# EAGLE design Battery Board V5 2 layer (EAGLE 8.4.3)
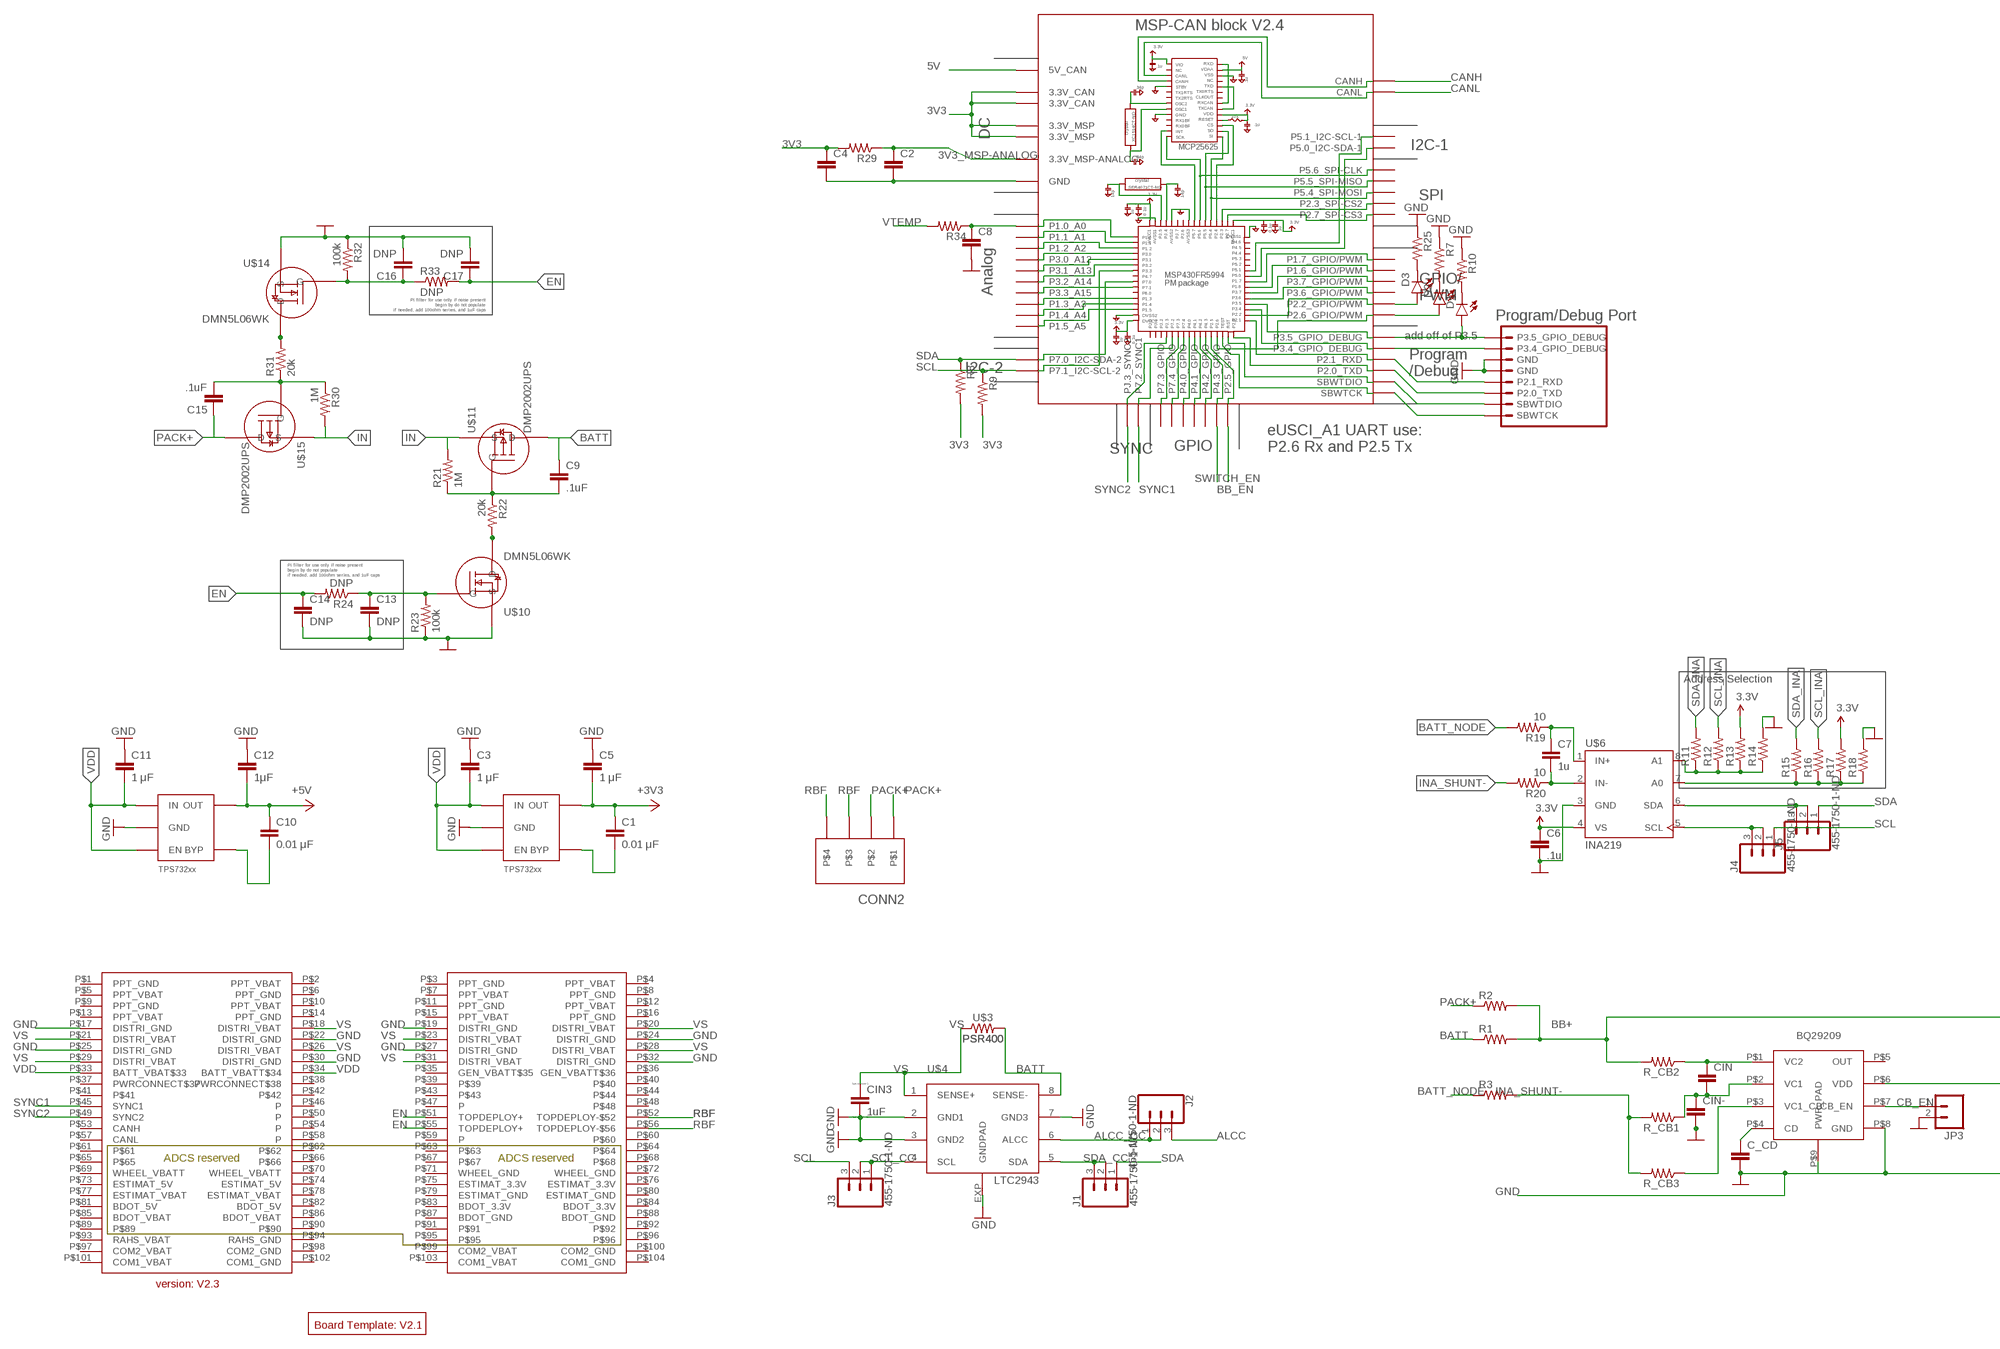
[diagram p0: schematic, sheet 1, part 1 of 2]
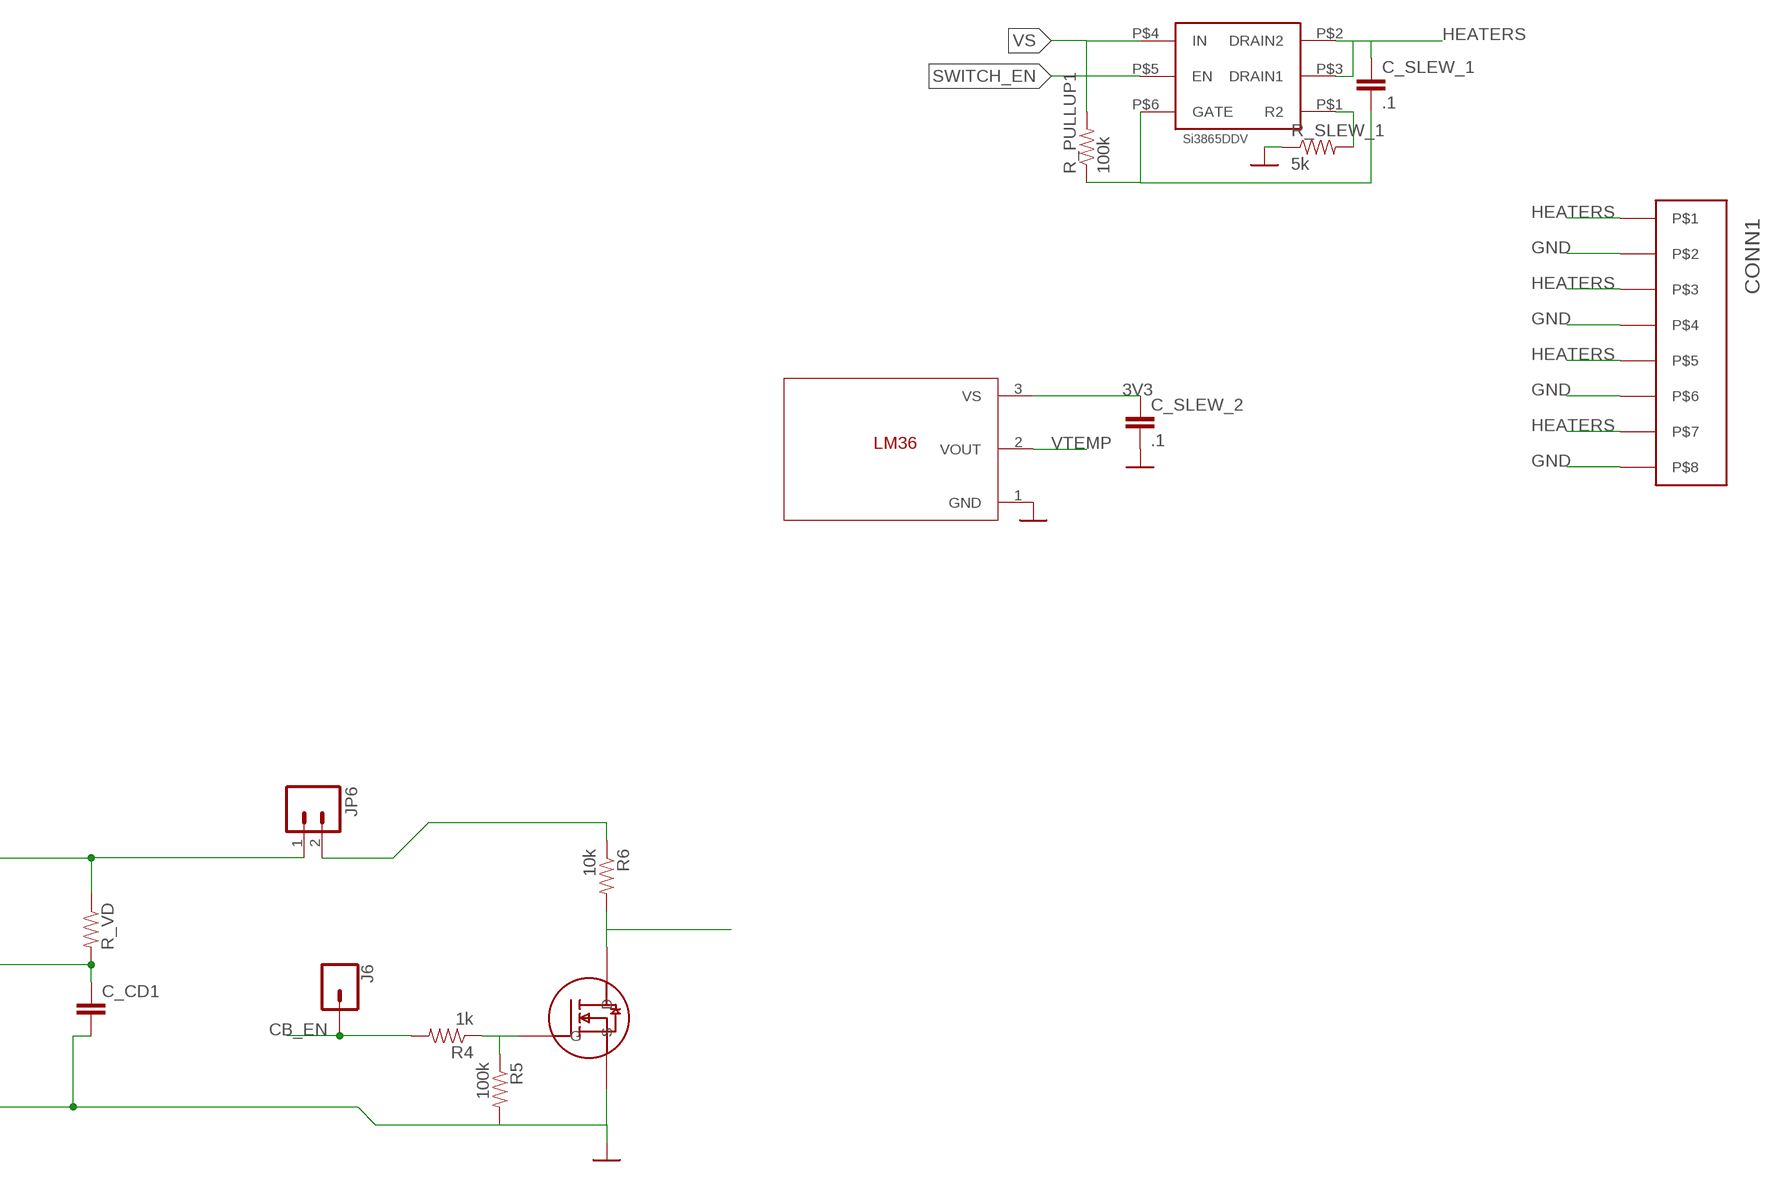
[diagram p1: schematic, sheet 1, part 2 of 2]

## Parts
BLK1  MSP-CAN_BLOCK  [MSP-CAN_BLOCK]
C1  0.01 μF  CAPACITOR0805  [0805]
C2  CAPACITOR0805  [0805]
C3  1 μF  CAPACITOR0805  [0805]
C4  CAPACITOR0805  [0805]
C5  1 μF  CAPACITOR0805  [0805]
C6  .1u  CAPACITOR0805  [0805]
C7  1u  CAPACITOR0805  [0805]
C8  CAPACITOR0805  [0805]
C9  .1uF  CAPACITOR0805  [0805]
C10  0.01 μF  CAPACITOR0805  [0805]
C11  1 μF  CAPACITOR0805  [0805]
C12  1μF  CAPACITOR0805  [0805]
C13  DNP  CAPACITOR0805  [0805]
C14  DNP  CAPACITOR0805  [0805]
C15  .1uF  CAPACITOR0805  [0805]
C16  DNP  CAPACITOR0805  [0805]
C17  DNP  CAPACITOR0805  [0805]
C_CD  CAPACITOR0805  [0805]
C_CD1  CAPACITOR0805  [0805]
C_SLEW_1  .1  CAPACITOR0805  [0805]
C_SLEW_2  .1  CAPACITOR0805  [0805]
CIN  CAPACITOR0805  [0805]
CIN3  1uF  C  [C0805]
CIN-  CAPACITOR0805  [0805]
CONN1  PICOLOCK_8  [PICOLOCK_8]
CONN2  PICOLOCK_4  [PICOLOCK_4]
D1  LED  [LED-1206]
D2  LED  [LED-1206]
D3  LED  [LED-1206]
J1  455-1750-1-ND  CONN_03  [1X03]
J2  455-1750-1-ND  CONN_03  [1X03]
J3  455-1750-1-ND  CONN_03  [1X03]
J4  455-1750-1-ND  CONN_03  [1X03]
J5  455-1750-1-ND  CONN_03  [1X03]
J6  CONN_01  [1X01]
JP3  M02LOCK  [1X02_LOCK]
JP6  M02LOCK  [1X02_LOCK]
R1  RESISTOR0805  [0805]
R2  RESISTOR0805  [0805]
R3  RESISTOR2010  [R2010]
R4  1k  RESISTOR0805  [0805]
R5  100k  RESISTOR0805  [0805]
R6  10k  RESISTOR0805  [0805]
R7  RESISTOR0805  [0805]
R8  RESISTOR0805  [0805]
R9  RESISTOR0805  [0805]
R10  RESISTOR0805  [0805]
R11  RESISTOR0805  [0805]
R12  RESISTOR0805  [0805]
R13  RESISTOR0805  [0805]
R14  RESISTOR0805  [0805]
R15  RESISTOR0805  [0805]
R16  RESISTOR0805  [0805]
R17  RESISTOR0805  [0805]
R18  RESISTOR0805  [0805]
R19  10  RESISTOR0805  [0805]
R20  10  RESISTOR0805  [0805]
R21  1M  RESISTOR0805  [0805]
R22  20k  RESISTOR0805  [0805]
R23  100k  RESISTOR0805  [0805]
R24  DNP  RESISTOR0805  [0805]
R25  RESISTOR0805  [0805]
R29  RESISTOR0805  [0805]
R30  1M  RESISTOR0805  [0805]
R31  20k  RESISTOR0805  [0805]
R32  100k  RESISTOR0805  [0805]
R33  DNP  RESISTOR0805  [0805]
R34  RESISTOR0805  [0805]
R_CB1  RESISTOR0805  [0805]
R_CB2  RESISTOR0805  [0805]
R_CB3  RESISTOR0805  [0805]
R_PULLUP1  100k  RESISTOR0805  [0805]
R_SLEW_1  5k  RESISTOR0805  [0805]
R_VD  RESISTOR0805  [0805]
U1  TPS732XX  [SOT-23-5]
U4  TPS732XX  [SOT-23-5]
U$1  BOARD_TEMPLATE1  [BOARD_TEMPLATE]
U$2  PC104_CONNECTOR  [PC104_CONNECTOR]
U$3  PSR400  [PSR400]
U$4  LTC2943  [DFN8(3X3)LT]
U$5  BQ29209  [VSON8]
U$6  INA219  [SOT-23-8]
U$7  DMN62D0U  [SOT-23-3]
U$8  LM36  [TO-92-3]
U$10  DMN5L06WK  [SOT-323]
U$11  DMP2002UPS  [POWERDI5060-8]
U$12  PROGRAM/DEBUG_PORT  [1X08_CONNECTOR]
U$14  DMN5L06WK  [SOT-323]
U$15  DMP2002UPS  [POWERDI5060-8]
U$16  SI3865DDV  [TSOP-6]

## Nets
3V3: BLK1.3.3V@CAN1(3.3V_CAN) BLK1.3.3V@CAN2(3.3V_CAN) BLK1.3.3V@MSP1(3.3V_MSP) BLK1.3.3V@MSP2(3.3V_MSP) C1.1 C4.1 C5.2 C6.1 C_SLEW_2.1 R8.2 R9.2 R13.2 R17.2 R29.2 U1.P$5(OUT) U$6.4(VS) U$8.3(VS) ; supply symbol labelled +3V3, 3.3V
3V3_MSP-ANALOG: BLK1.3.3V_ANALOG@MSP2(3.3V_MSP-ANALOG) C2.1 R29.1
5V: BLK1.5V(5V_CAN) C10.1 C12.2 U4.P$5(OUT) ; supply symbol labelled +5V
ALCC: J2.3
ALCC_CC: J2.1 J2.2 U$4.6(ALCC)
BATT: C9.1 R1.1 U$3.P$2 U$4.8(SENSE-) U$11.D1(D) U$11.D2(D) U$11.D3(D) U$11.D4(D) U$11.D5(D)
BATT_NODE: R3.1 R19.2
BB+: JP6.1 R1.2 R2.2 R_CB2.2 R_VD.1
BB_EN: BLK1.P2.5_GPIO R6.2 U$7.3(D)
CANH: BLK1.CANH
CANL: BLK1.CANL
CB_EN: J6.1 JP3.1 R4.2 U$5.P$7(CB_EN)
EN: C14.1 C17.1 R24.2 R33.2 U$2.P$51(TOPDEPLOY+) U$2.P$55(TOPDEPLOY+)
GND: BLK1.GND@1(GND) BLK1.GND@2(GND) BLK1.GND@3(GND) BLK1.GND@4(GND) BLK1.GND@5(GND) BLK1.GND@7(GND) BLK1.GND@8(GND) BLK1.GND@9(GND) BLK1.GND@10(GND) BLK1.GND@11(GND) BLK1.GND@12(GND) BLK1.GND@13(GND) BLK1.GND@14(GND) BLK1.GND@15(GND) BLK1.GND@16(GND) BLK1.GND@17(GND) BLK1.GND@26(GND) C2.2 C3.1 C4.2 C5.1 C6.2 C8.2 C11.1 C12.1 C13.2 C14.2 C16.2 C17.2 C_CD1.2 C_CD.2 C_SLEW_2.2 CIN3.2 CIN-.2 CONN1.P$2 CONN1.P$4 CONN1.P$6 CONN1.P$8 JP3.2 R5.2 R7.1 R10.1 R14.2 R18.2 R23.1 R25.1 R32.1 R_SLEW_1.1 U1.P$2(GND) U4.P$2(GND) U$2.P$17(DISTRI_GND) U$2.P$19(DISTRI_GND) U$2.P$22(DISTRI_GND) U$2.P$24(DISTRI_GND) U$2.P$25(DISTRI_GND) U$2.P$27(DISTRI_GND) U$2.P$30(DISTRI_GND) U$2.P$32(DISTRI_GND) U$4.2(GND1) U$4.3(GND2) U$4.7(GND3) U$4.EXP(GNDPAD) U$5.P$8(GND) U$5.P$9(PWR_PAD) U$6.3(GND) U$7.2(S) U$8.1(GND) U$10.2(S) U$12.5(GND) U$12.6(GND) U$14.2(S) ; supply symbol labelled DGND
HEATERS: C_SLEW_1.1 CONN1.P$1 CONN1.P$3 CONN1.P$5 CONN1.P$7 U$16.P$2(DRAIN2) U$16.P$3(DRAIN1)
IN: R21.2 R30.2 U$11.S1(S) U$11.S2(S) U$11.S3(S) U$15.S1(S) U$15.S2(S) U$15.S3(S)
INA219_A0_1: R15.1 R16.1 R17.1 R18.1 U$6.7(A0)
INA219_A1_1: R11.1 R12.1 R13.1 R14.1 U$6.8(A1)
INA219_IN+_1: C7.1 R19.1 U$6.1(IN+)
INA219_IN-_1: C7.2 R20.1 U$6.2(IN-)
INA_SHUNT-: R3.2 R20.2 R_CB1.2 R_CB3.2
LDO_3V3_BYP1: C1.2 U1.P$4(BYP)
LDO_5V_BYP1: C10.2 U4.P$4(BYP)
N$1: BLK1.P3.5_GPIO_DEBUG D1.A U$12.8(P3.5_GPIO_DEBUG)
N$2: JP6.2 R6.1
N$3: BLK1.P3.4_GPIO_DEBUG U$12.7(P3.4_GPIO_DEBUG)
N$4: BLK1.P2.1_RXD U$12.4(P2.1_RXD)
N$5: CIN.1 R_CB2.1 U$5.P$1(VC2)
N$6: CIN-.1 CIN.2 R_CB1.1 U$5.P$2(VC1)
N$7: C9.2 R21.1 R22.1 U$11.G
N$8: C13.1 R23.2 R24.1 U$10.1(G)
N$9: R_CB3.1 U$5.P$3(VC1_CB)
N$10: C_CD.1 U$5.P$4(CD)
N$11: R22.2 U$10.3(D)
N$12: R4.1 R5.1 U$7.1(G)
N$13: C_CD1.1 R_VD.2 U$5.P$6(VDD)
N$14: C15.2 R30.1 R31.1 U$15.G
N$16: C16.1 R32.2 R33.1 U$14.1(G)
N$17: R31.2 U$14.3(D)
N$18: BLK1.P2.0_TXD U$12.3(P2.0_TXD)
N$19: BLK1.SBWTDIO U$12.2(SBWTDIO)
N$20: BLK1.SBWTCK U$12.SBWTCK
N$21: D1.C R10.2
N$22: BLK1.P1.0_A0 C8.1 R34.1
N$23: D2.C R7.2
N$24: D3.C R25.2
N$25: R_SLEW_1.2 U$16.P$1(R2)
N$26: C_SLEW_1.2 R_PULLUP1.1 U$16.P$6(GATE)
N$27: BLK1.P2.2_GPIO/PWM D3.A
N$28: BLK1.P2.6_GPIO/PWM D2.A
PACK+: C15.1 CONN2.P$1 CONN2.P$2 R2.1 U$15.D1(D) U$15.D2(D) U$15.D3(D) U$15.D4(D) U$15.D5(D)
RBF: CONN2.P$3 CONN2.P$4 U$2.P$52(TOPDEPLOY-$52) U$2.P$56(TOPDEPLOY-$56)
SCL: BLK1.P7.1_I2C-SCL-2 J3.3 J4.1 R9.1
SCL_CC: J3.1 J3.2 U$4.4(SCL)
SCL_INA: J4.2 J4.3 R12.2 R16.2 U$6.5(SCL)
SDA: BLK1.P7.0_I2C-SDA-2 J1.1 J5.1 R8.1
SDA_CC: J1.2 J1.3 U$4.5(SDA)
SDA_INA: J5.2 J5.3 R11.2 R15.2 U$6.6(SDA)
SWITCH_EN: BLK1.P4.3_GPIO U$16.P$5(EN)
SYNC1: BLK1.P7.2_SYNC1 U$2.P$45(SYNC1)
SYNC2: BLK1.PJ.3_SYNC2 U$2.P$49(SYNC2)
VDD: C3.2 C11.2 U1.P$1(IN) U1.P$3(EN) U4.P$1(IN) U4.P$3(EN) U$2.P$33(BATT_VBAT$33) U$2.P$34(BATT_VBATT$34)
VS: CIN3.1 R_PULLUP1.2 U$2.P$18(DISTRI_VBAT) U$2.P$20(DISTRI_VBAT) U$2.P$21(DISTRI_VBAT) U$2.P$23(DISTRI_VBAT) U$2.P$26(DISTRI_VBAT) U$2.P$28(DISTRI_VBAT) U$2.P$29(DISTRI_VBAT) U$2.P$31(DISTRI_VBAT) U$3.P$1 U$4.1(SENSE+) U$16.P$4(IN)
VTEMP: R34.2 U$8.2(VOUT)
Unconnected: BLK1.P1.1_A1 BLK1.P1.2_A2 BLK1.P1.3_A3 BLK1.P1.4_A4 BLK1.P1.5_A5 BLK1.P1.6_GPIO/PWM BLK1.P1.7_GPIO/PWM BLK1.P2.4_SPI-CS2(P2.3_SPI-CS2) BLK1.P2.7_SPI-CS3 BLK1.P3.0_A12 BLK1.P3.1_A13 BLK1.P3.2_A14 BLK1.P3.3_A15 BLK1.P3.6_GPIO/PWM BLK1.P3.7_GPIO/PWM BLK1.P4.0_GPIO BLK1.P4.1_GPIO BLK1.P4.2_GPIO BLK1.P5.0_I2C-SDA-1 BLK1.P5.1_I2C-SCL-1 BLK1.P5.4_SPI-MOSI BLK1.P5.5_SPI-MISO BLK1.P5.6_SPI-CLK BLK1.P7.3_GPIO BLK1.P7.4_GPIO U$2.P$1(PPT_GND) U$2.P$2(PPT_VBAT) U$2.P$3(PPT_GND) U$2.P$4(PPT_VBAT) U$2.P$5(PPT_VBAT) U$2.P$6(PPT_GND) U$2.P$7(PPT_VBAT) U$2.P$8(PPT_GND) U$2.P$9(PPT_GND) U$2.P$10(PPT_VBAT) U$2.P$11(PPT_GND) U$2.P$12(PPT_VBAT) U$2.P$13(PPT_VBAT) U$2.P$14(PPT_GND) U$2.P$15(PPT_VBAT) U$2.P$16(PPT_GND) U$2.P$35(GEN_VBATT$35) U$2.P$36(GEN_VBATT$36) U$2.P$37(PWRCONNECT$37) U$2.P$38(PWRCONNECT$38) U$2.P$39 U$2.P$40 U$2.P$41 U$2.P$42 U$2.P$43 U$2.P$44 U$2.P$46(P) U$2.P$47(P) U$2.P$48 U$2.P$50(P) U$2.P$53(CANH) U$2.P$54(P) U$2.P$57(CANL) U$2.P$58(P) U$2.P$59(P) U$2.P$60 U$2.P$61 U$2.P$62 U$2.P$63 U$2.P$64 U$2.P$65 U$2.P$66 U$2.P$67 U$2.P$68 U$2.P$69(WHEEL_VBATT) U$2.P$70(WHEEL_VBATT) U$2.P$71(WHEEL_GND) U$2.P$72(WHEEL_GND) U$2.P$73(ESTIMAT_5V) U$2.P$74(ESTIMAT_5V) U$2.P$75(ESTIMAT_3.3V) U$2.P$76(ESTIMAT_3.3V) U$2.P$77(ESTIMAT_VBAT) U$2.P$78(ESTIMAT_VBAT) U$2.P$79(ESTIMAT_GND) U$2.P$80(ESTIMAT_GND) U$2.P$81(BDOT_5V) U$2.P$82(BDOT_5V) U$2.P$83(BDOT_3.3V) U$2.P$84(BDOT_3.3V) U$2.P$85(BDOT_VBAT) U$2.P$86(BDOT_VBAT) U$2.P$87(BDOT_GND) U$2.P$88(BDOT_GND) U$2.P$89 U$2.P$90 U$2.P$91 U$2.P$92 U$2.P$93(RAHS_VBAT) U$2.P$94(RAHS_GND) U$2.P$95 U$2.P$96 U$2.P$97(COM2_VBAT) U$2.P$98(COM2_GND) U$2.P$99(COM2_VBAT) U$2.P$100(COM2_GND) U$2.P$101(COM1_VBAT) U$2.P$102(COM1_GND) U$2.P$103(COM1_VBAT) U$2.P$104(COM1_GND) U$5.P$5(OUT)

## Notes on the sheet
- Pi filter for use only if noise present
  begin by do not populate
  if needed, add 100ohm series, and 1uF caps
- Pi filter for use only if noise present
  begin by do not populate
  if needed, add 100ohm series, and 1uF caps
- Address Selection

## Library data of the parts
BLK1 = DubSat1 Components:MSP-CAN_BLOCK
C1-C17 C_CD C_CD1 C_SLEW_1 C_SLEW_2 CIN CIN- = DubSat1 Components:CAPACITOR: Capacitor Standard 0603 ceramic capacitor, and 0.1" leaded capacitor.
CIN3 = eagle-ltspice:C: CAPACITOR, European symbol; SPICEMODEL: NONE; SPICEPREFIX: C
CONN1 = DubSat1 Components:PICOLOCK_8
CONN2 = DubSat1 Components:PICOLOCK_4
D1-D3 = DubSat1 Components:LED
J1-J5 = SparkFun-Connectors:CONN_03: Multi connection point. Often used as Generic Header-pin footprint for 0.1 inch spaced/style header connections On any of the 0.1 inch spaced packages, you can populate with these: Break Away Headers - Straight <https://www.sparkfun.com/products/116> (PRT-00116) Break Away Male Headers - Right Angle <https://www.sparkfun.com/products/553> (PRT-00553) Female Headers <https://www.sparkfun.com/products/115> (PRT-00115) Break Away Headers - Machine Pin <https://www.sparkfun.com/products/117> (PRT-00117) Break Away Female Headers - Swiss Machine Pin <https://www.sparkfun.com/products/743> (PRT-00743) Stackable Header - 3 Pin (Female, 0.1") <https://www.sparkfun.com/products/13875> (PRT-13875) For SCREWTERMINALS and SPRING TERMINALS visit here: Screw Terimnals on SparkFun.com <https://www.sparkfun.com/search/results?term=Screw+Terminals> (5mm/3.5mm/2.54mm spacing) This device is also useful as a general connection point to wire up your design to another part of your project. Our various solder wires solder well into these plated through hole pads. Hook-Up Wire - Assortment (Stranded, 22 AWG) <https://www.sparkfun.com/products/11375> (PRT-11375) Hook-Up Wire - Assortment (Solid Core, 22 AWG) <https://www.sparkfun.com/products/11367> (PRT-11367) View the entire wire category on our website here <https://www.sparkfun.com/categories/141> Special notes: Molex polarized connector foot print use with SKU : PRT-08232 with associated crimp pins and housings.; PROD_ID: XXX-00000
J6 = SparkFun-Connectors:CONN_01: Single connection point. Often used as Generic Header-pin footprint for 0.1 inch spaced/style header connections On any of the 0.1 inch spaced packages, you can populate with these: Break Away Headers - Straight <https://www.sparkfun.com/products/116> (PRT-00116) Break Away Male Headers - Right Angle <https://www.sparkfun.com/products/553> (PRT-00553) Female Headers <https://www.sparkfun.com/products/115> (PRT-00115) Break Away Headers - Machine Pin <https://www.sparkfun.com/products/117> (PRT-00117) Break Away Female Headers - Swiss Machine Pin <https://www.sparkfun.com/products/743> (PRT-00743) This device is also useful as a general connection point to wire up your design to another part of your project. Our various solder wires solder well into these plated through hole pads. Hook-Up Wire - Assortment (Stranded, 22 AWG) <https://www.sparkfun.com/products/11375> (PRT-11375) Hook-Up Wire - Assortment (Solid Core, 22 AWG) <https://www.sparkfun.com/products/11367> (PRT-11367) View the entire wire category on our website here <https://www.sparkfun.com/categories/141> Special notes: SMTSO-256-ET is a "flush mount" nut for a 4-40 screw. We mostly use this on specialty testbeds; it is a nice way to connect hardware to your PCB at an adjustable hieght. Also note, the SNAP packages are for using a snappable style connector. We sell a baggie of snaps and they are also used on two LilyPad designs: Snap Assortment - 30 pack (male and female) <https://www.sparkfun.com/products/11347> (DEV-11347) LilyPad Arduino SimpleSnap <https://www.sparkfun.com/products/10941> (DEV-10941) LilyPad SimpleSnap Protoboard <https://www.sparkfun.com/products/10940> (DEV-10940)
JP3 JP6 = SparkFun-Connectors:M02: Standard 2-pin 0.1" header. Use with - straight break away headers ( PRT-00116) - right angle break away headers (PRT-00553) - swiss pins (PRT-00743) - machine pins (PRT-00117) - female headers (PRT-00115) Molex polarized connector foot print use with: PRT-08233 with associated crimp pins and housings. 2.54_SCREWTERM for use with PRT-10571. 3.5mm Screw Terminal footprints for PRT-08084 5mm Screw Terminal footprints for use with PRT-08432
R1-R25 R29-R34 R_CB1-R_CB3 R_PULLUP1 R_SLEW_1 R_VD = DubSat1 Components:RESISTOR: Resistor Basic schematic elements and footprints for 0603, 1206, and PTH resistors.
U1 U4 = DubSat1 Components:TPS732XX
U$1 = DubSat1 Components:BOARD_TEMPLATE
U$2 = DubSat1 Components:PC104_CONNECTOR
U$3 = Parts for Power Team1:PSR400
U$4 = Parts for Power Team1:LTC2943
U$5 = DubSat1 Components:BQ29209
U$6 = DubSat1 Components:INA219
U$7 = DubSat1 Components:DMN62D0U
U$8 = DubSat1 Components:LM36
U$10 U$14 = DubSat1 Components:DMN5L06WK
U$11 U$15 = DubSat1 Components:DMP2002UPS
U$12 = DubSat1 Components:PROGRAM/DEBUG_PORT
U$16 = DubSat1 Components:SI3865DDV

## Board
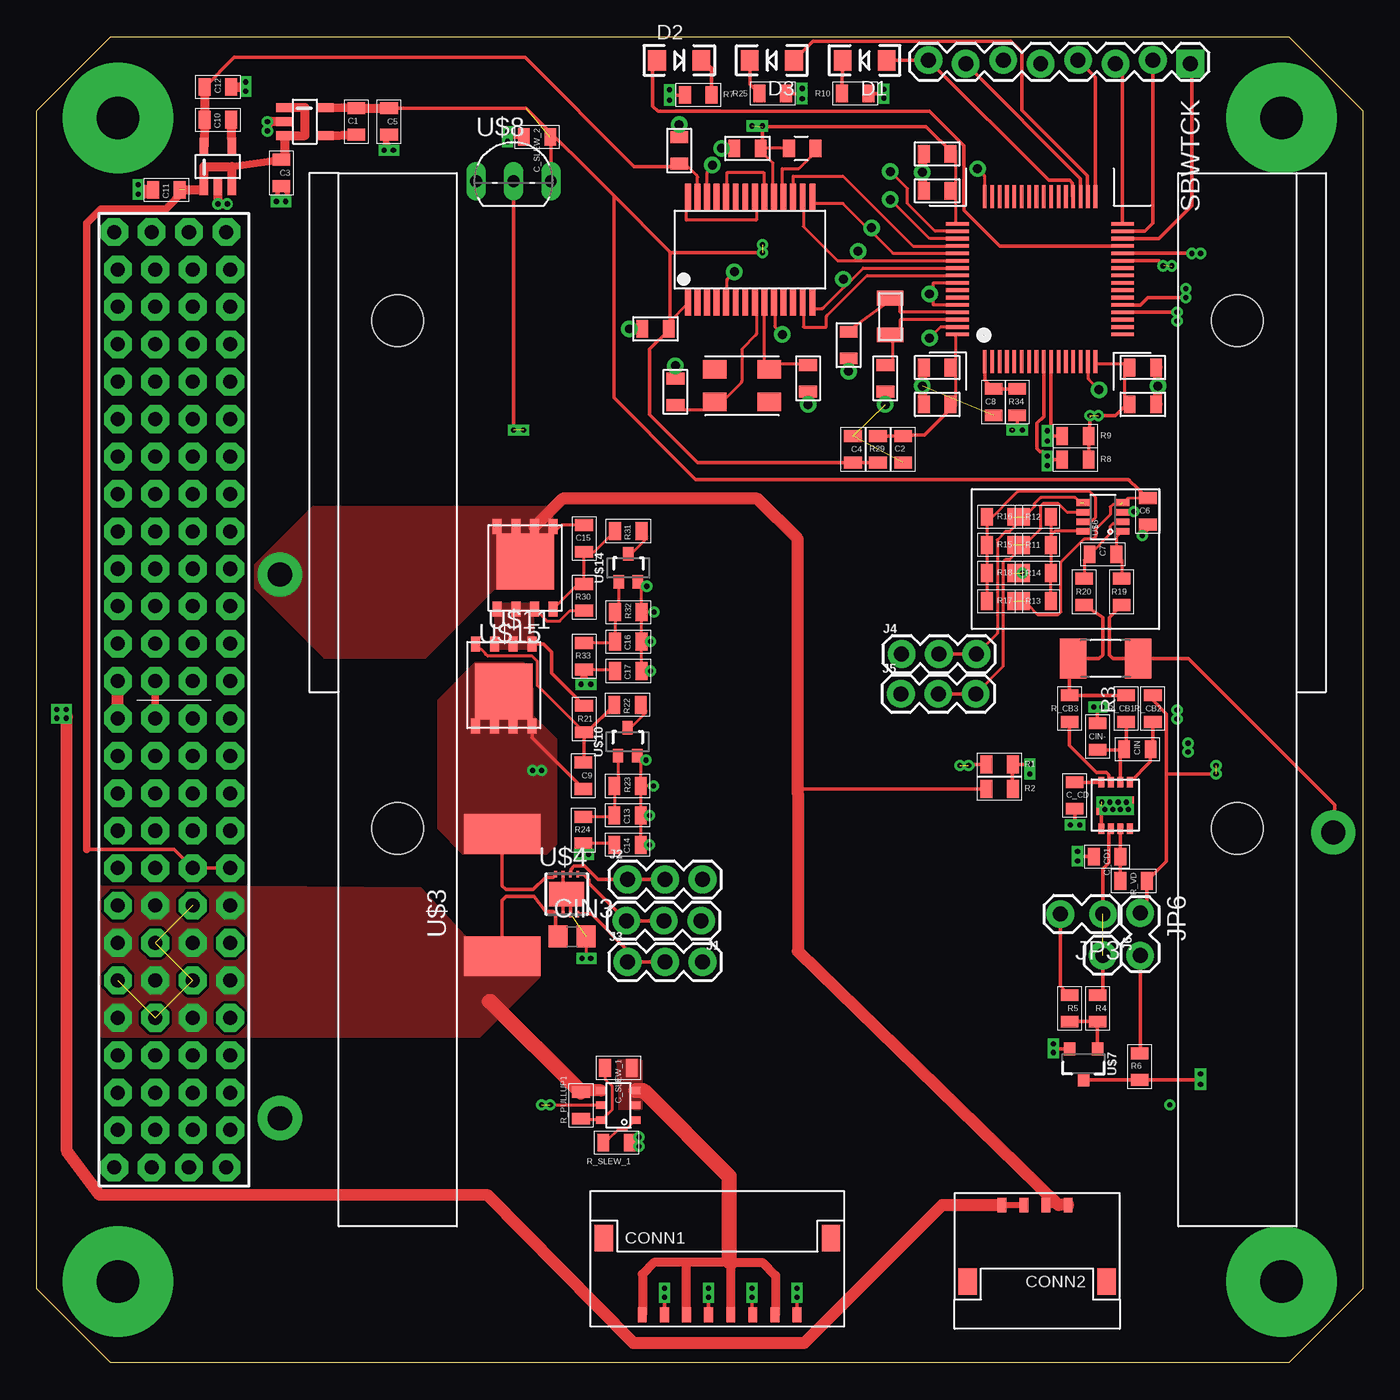
[diagram p2: board, top side]
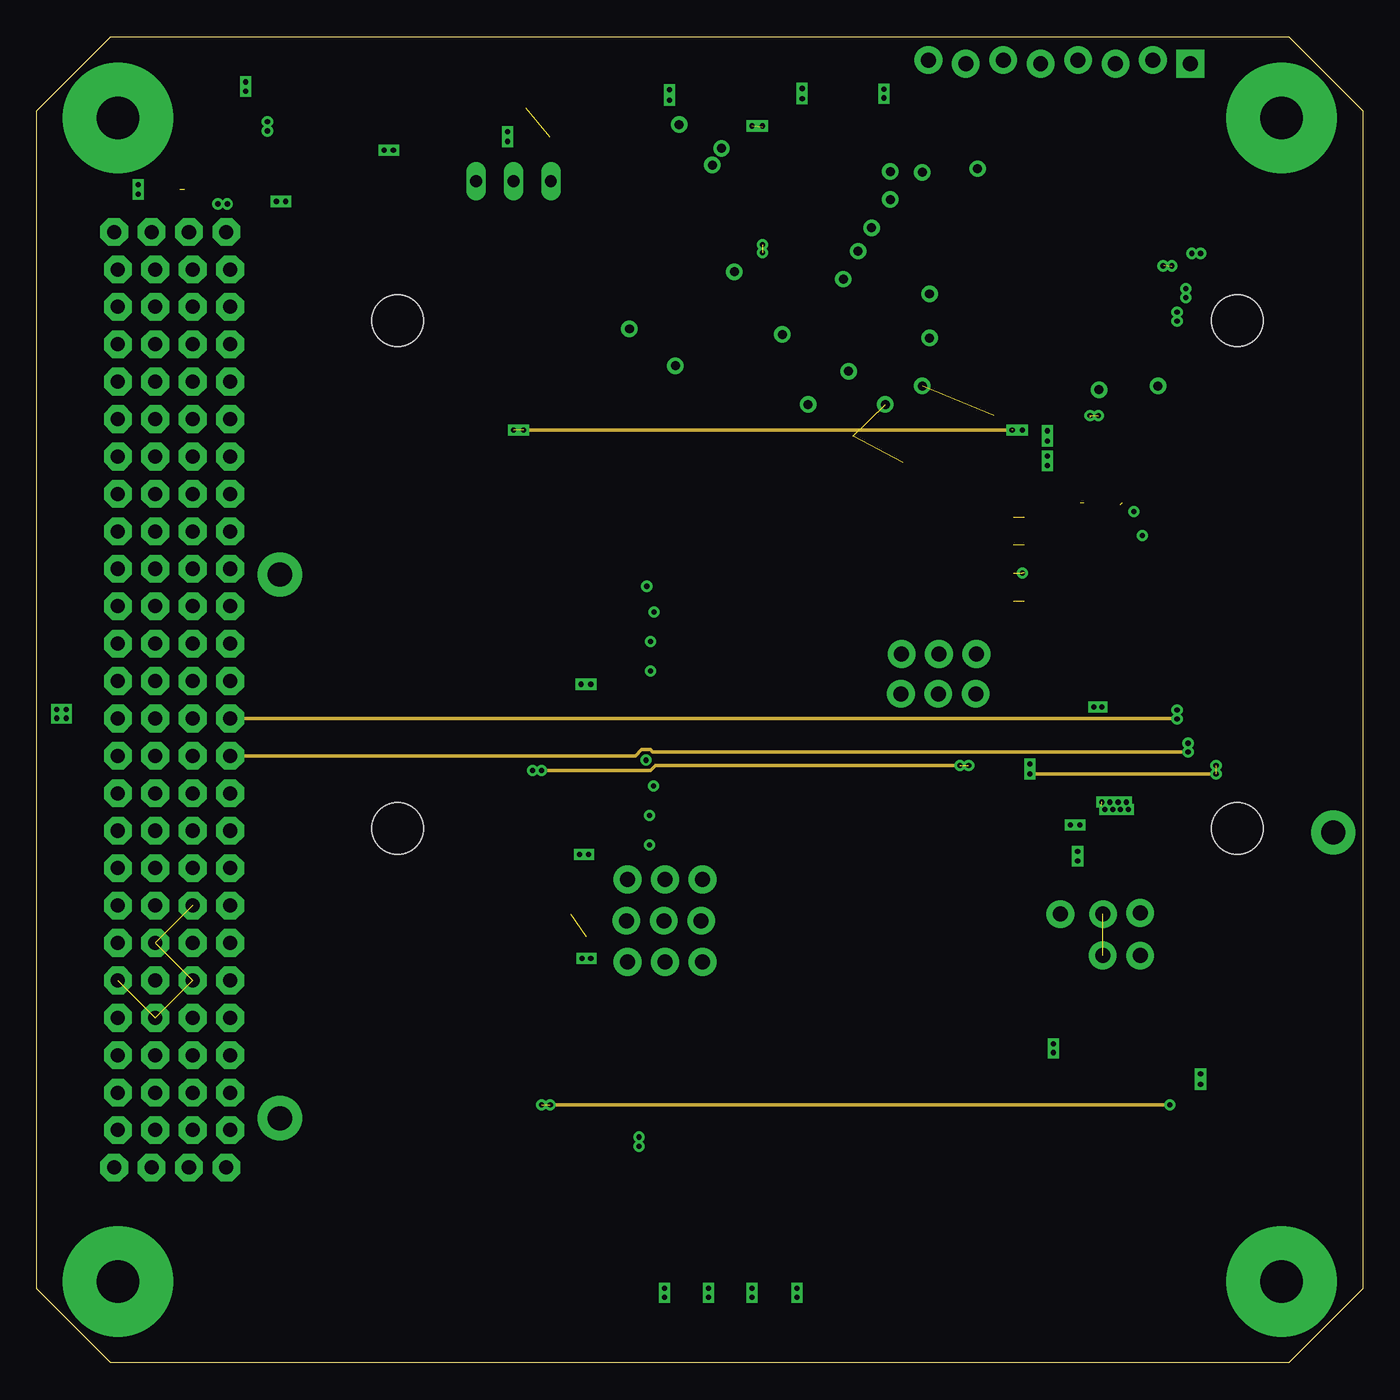
[diagram p3: board, inner layer Route2]
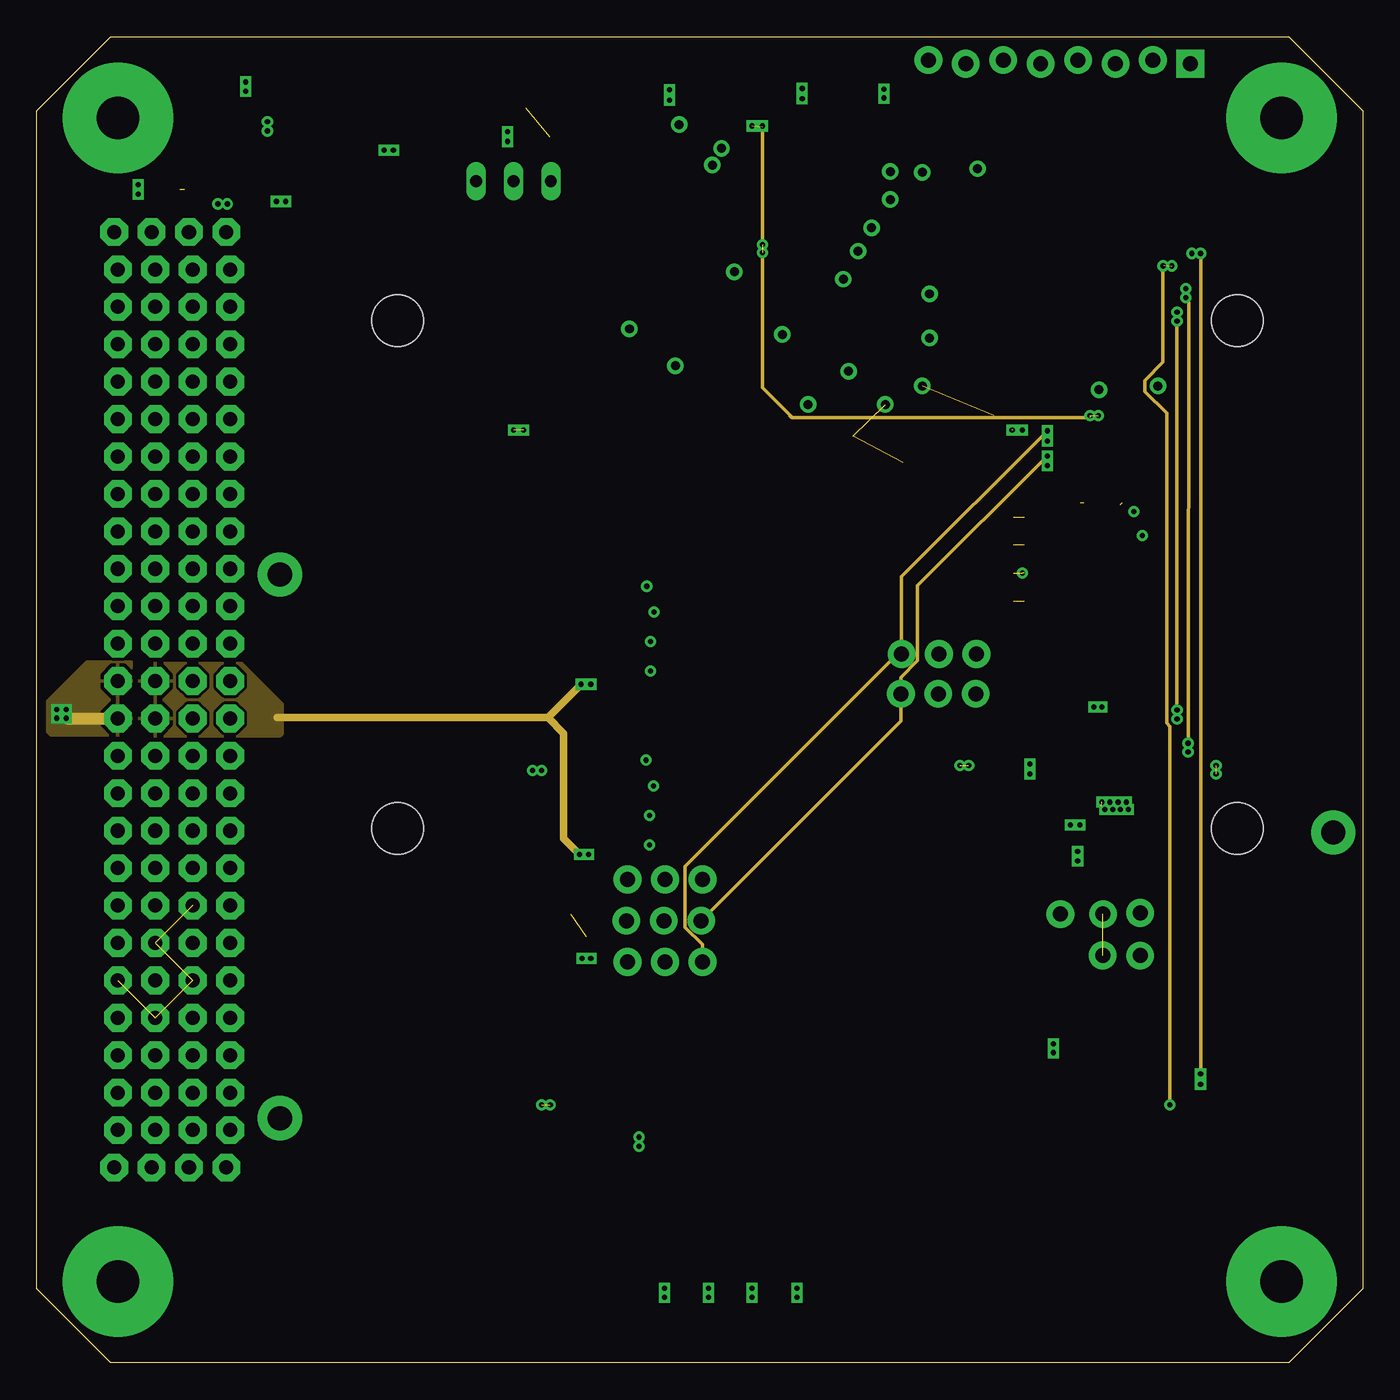
[diagram p4: board, inner layer Route15]
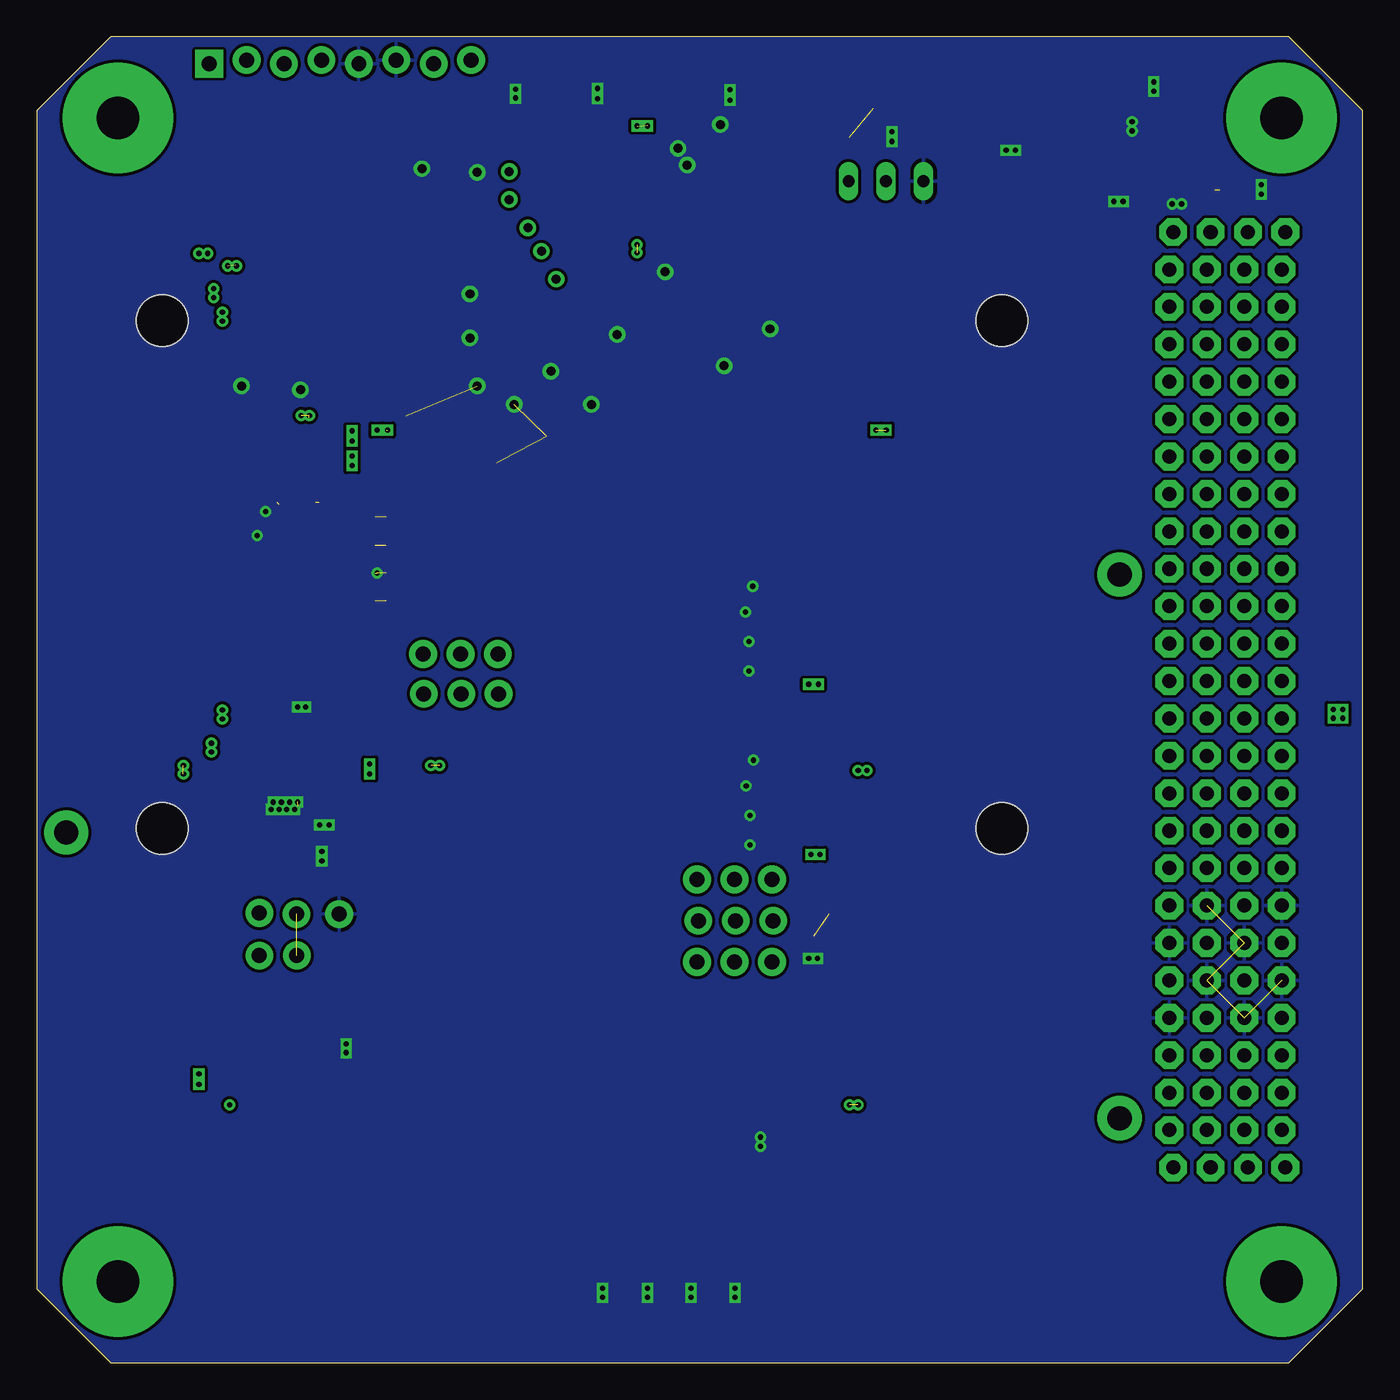
[diagram p5: board, bottom side, seen from below]

Size 90 x 90 mm. Coordinates in mm from the lower left corner, seen from the top.
Copper layers (1*2*15*16): Top 0.035mm / dielectric 1.5mm / Route2 0.035mm / dielectric 0.15mm / Route15 0.035mm / dielectric 0.2mm / Bottom 0.035mm
Design rules "default *": minimum track width 8mil, minimum drill 0.3mm, track to track 8mil, track to pad 8mil, pad to pad 8mil, via to via 8mil, smd to smd 0mil, copper to edge 1mil, drill to drill 3mil, minimum pad ring 10mil, minimum via ring 8mil, stop-mask expansion 4mil, vias tented up to drill 0mil, thermal gap 10mil

### Footprints (pad centres in the part's own frame; a part is rotated, then mirrored left to right if it is on the bottom)
MSP-CAN_BLOCK = smd 1.2 x 0.8: 1 -6,6.08; 2 -6,7.88; 3 -8.5,6.08; 4 -8.5,7.88; 9 -8.5,-6.08; 10 -8.5,-7.88; 11 -6,-6.08; 12 -6,-7.88; 13 8.5,6.08; 14 8.5,7.88; 15 6,6.08; 16 6,7.88; 23 8.875,18.955; 24 8.875,20.755; 25 8.875,17.045; 26 8.875,15.245; 27 -3.375,25.205; 28 -3.375,27.005 | smd 1 x 0.25: 3.3V@CAN1 -3.375,25.125; 3.3V@CAN2 8.875,18.875; 3.3V@MSP1 8.501,5.884; 3.3V@MSP2 -8.533,-5.962; 3.3V_ANALOG@MSP2 -8.482,5.904 | smd 0.8 x 1.2: 5 -5.83,10.5; 6 -7.63,10.5; 7 -3.58,13; 8 -5.38,13; 17 -8.545,24.75; 18 -6.745,24.75; 19 -5.83,15.75; 20 -7.63,15.75; 21 7.83,24.5; 22 9.63,24.5 | smd 0.25 x 1: 5V 7.65,24.5 | smd 1.75 x 0.4: CANH -1.6,21.96; CANL -1.6,22.61; P$65 -1.6,23.91; P$66 -1.6,23.26; P$69 -1.6,21.31; P$70 -1.6,20.66; P$71 -1.6,20.01; P$72 -1.6,19.36; P$73 -1.6,18.71; P$74 -1.6,18.06; P$75 -1.6,17.41; P$76 -1.6,16.76; P$77 -1.6,16.11; P$78 -1.6,15.46; P$79 5.6,15.46; P$80 5.6,16.11; P$81 5.6,16.76; P$82 5.6,17.41; P$83 5.6,18.06; P$84 5.6,18.71; P$85 5.6,19.36; P$86 5.6,20.01; P$87 5.6,20.66; P$88 5.6,21.31; P$89 5.6,21.96; P$90 5.6,22.61; P$91 5.6,23.26; P$92 5.6,23.91 | drill 0.61: GND@1 -3.375,27.875; GND@2 -5.875,24.75; GND@3 -3.75,17.5; GND@4 0.5,20.75; GND@5 -8.5,15.75; GND@7 -8.5,10.5; GND@8 -7.25,8; GND@9 -4,7.5; GND@10 -1,7.5; GND@11 7.75,22.25; GND@12 10.5,24.5; GND@13 8.875,21.625; GND@14 7.25,8; GND@15 7.5,4.25; GND@16 -7.5,-4; GND@17 -7.25,-8; GND@26 -6.25,13; P2.4_SPI-CS2 5.397,10.16; P2.7_SPI-CS3 7.303,10.16; P5.4_SPI-MOSI 3.487,11.434; P5.5_SPI-MISO 1.9,12.354; P5.6_SPI-CLK 0,13.348 | smd 1.55 x 0.25: P1.0_A0 -5.6,3.75; P1.1_A1 -5.6,3.25; P1.2_A2 -5.6,2.75; P1.3_A3 -5.6,-1.75; P1.4_A4 -5.6,-2.25; P1.5_A5 -5.6,-2.75; P1.6_GPIO/PWM 5.6,-0.75; P1.7_GPIO/PWM 5.6,-0.25; P2.1_RXD 5.6,-3.75; P2.2_GPIO/PWM 5.6,-3.25; P3.0_A12 -5.6,2.25; P3.1_A13 -5.6,1.75; P3.2_A14 -5.6,1.25; P3.3_A15 -5.6,0.75; P3.4_GPIO_DEBUG 5.6,-2.75; P3.5_GPIO_DEBUG 5.6,-2.25; P3.6_GPIO/PWM 5.6,-1.75; P3.7_GPIO/PWM 5.6,-1.25; P5.0_I2C-SDA-1 5.6,0.25; P5.1_I2C-SCL-1 5.6,0.75; P7.0_I2C-SDA-2 -5.6,-0.25; P7.1_I2C-SCL-2 -5.6,-0.75; P$8 -5.6,0.25; P$11 -5.6,-1.25; P$15 -5.6,-3.25; P$16 -5.6,-3.75; P$43 5.6,1.25; P$44 5.6,1.75; P$45 5.6,2.25; P$46 5.6,2.75; P$47 5.6,3.25; P$48 5.6,3.75 | smd 0.25 x 1.55: P2.0_TXD 3.75,-5.6; P2.5_GPIO 1.75,-5.6; P2.6_GPIO/PWM 2.25,-5.6; P4.0_GPIO -0.25,-5.6; P4.1_GPIO 0.25,-5.6; P4.2_GPIO 0.75,-5.6; P4.3_GPIO 1.25,-5.6; P7.2_SYNC1 -1.75,-5.6; P7.3_GPIO -1.25,-5.6; P7.4_GPIO -0.75,-5.6; P$17 -3.75,-5.6; P$18 -3.25,-5.6; P$19 -2.75,-5.6; P$49 3.75,5.6; P$50 3.25,5.6; P$51 2.75,5.6; P$52 2.25,5.6; P$53 1.75,5.6; P$54 1.25,5.6; P$55 0.75,5.6; P$56 0.25,5.6; P$57 -0.25,5.6; P$58 -0.75,5.6; P$59 -1.25,5.6; P$60 -1.75,5.6; P$61 -2.25,5.6; P$62 -2.75,5.6; P$63 -3.25,5.6; P$64 -3.75,5.6; PJ.3_SYNC2 -2.25,-5.6; SBWTCK 2.75,-5.6; SBWTDIO 3.25,-5.6 | smd 1 x 1.8: P$93 -3.79,10.16; P$94 -1.29,10.16 | smd 1.25 x 1.6: P$104 -6.13,18.38; P$105 -6.13,22.08; P$106 -8.33,22.08; P$107 -8.33,18.38
0805 = smd 0.8 x 1.2: 1 -0.9,0; 2 0.9,0
C0805 = smd 1.3 x 1.5: 1 -0.95,0; 2 0.95,0
PICOLOCK_8 = smd 1.25 x 1.8: MNT@1 -2.605,5.2; MNT@2 12.805,5.2 | smd 0.6 x 1: P$1 0,0; P$2 1.5,0; P$3 3,0; P$4 4.5,0; P$5 6,0; P$6 7.5,0; P$7 9,0; P$8 10.5,0
PICOLOCK_4 = smd 1.25 x 1.8: MNT@1 -2.605,5.2; MNT@2 6.805,5.2 | smd 0.6 x 1: P$1 0,0; P$2 1.5,0; P$3 3,0; P$4 4.5,0
LED-1206 = smd 1.2 x 1.4: A -1.5,0; C 1.5,0
1X03 = drill 1.016 pad 1.88: 1 0,0; 2 2.54,0; 3 5.08,0
1X01 = drill 1.016 pad 1.88: 1 0,0
1X02_LOCK = drill 1.016 pad 1.88: 1 -0.178,0; 2 2.718,0
R2010 = smd 1.8 x 2.7: 1 -2.2,0; 2 2.2,0
SOT-23-5 = smd 0.6 x 1.2: P$1 -0.95,-1.35; P$2 0,-1.35; P$3 0.95,-1.35; P$4 0.95,1.35; P$5 -0.95,1.35
BOARD_TEMPLATE = drill 2.9 pad 7.5: P$1 -39.5,39.5; P$2 -39.5,-39.5; P$3 39.5,-39.5; P$4 39.5,39.5
PC104_CONNECTOR = drill 0.953 pad 1.88 octagon: P$1 -31.75,32.134; P$2 -31.75,34.674; P$3 -31.75,37.214; P$4 -31.75,39.754; P$5 -29.21,31.88; P$6 -29.21,34.42; P$7 -29.21,36.96; P$8 -29.21,39.5; P$9 -26.67,31.88; P$10 -26.67,34.42; P$11 -26.67,36.96; P$12 -26.67,39.5; P$13 -24.13,31.88; P$14 -24.13,34.42; P$15 -24.13,36.96; P$16 -24.13,39.5; P$17 -21.59,31.88; P$18 -21.59,34.42; P$19 -21.59,36.96; P$20 -21.59,39.5; P$21 -19.05,31.88; P$22 -19.05,34.42; P$23 -19.05,36.96; P$24 -19.05,39.5; P$25 -16.51,31.88; P$26 -16.51,34.42; P$27 -16.51,36.96; P$28 -16.51,39.5; P$29 -13.97,31.88; P$30 -13.97,34.42; P$31 -13.97,36.96; P$32 -13.97,39.5; P$33 -11.43,31.88; P$34 -11.43,34.42; P$35 -11.43,36.96; P$36 -11.43,39.5; P$37 -8.89,31.88; P$38 -8.89,34.42; P$39 -8.89,36.96; P$40 -8.89,39.5; P$41 -6.35,31.88; P$42 -6.35,34.42; P$43 -6.35,36.96; P$44 -6.35,39.5; P$45 -3.81,31.88; P$46 -3.81,34.42; P$47 -3.81,36.96; P$48 -3.81,39.5; P$49 -1.27,31.88; P$50 -1.27,34.42; P$51 -1.27,36.96; P$52 -1.27,39.5; P$53 1.27,31.88; P$54 1.27,34.42; P$55 1.27,36.96; P$56 1.27,39.5; P$57 3.81,31.88; P$58 3.81,34.42; P$59 3.81,36.96; P$60 3.81,39.5; P$61 6.35,31.88; P$62 6.35,34.42; P$63 6.35,36.96; P$64 6.35,39.5; P$65 8.89,31.88; P$66 8.89,34.42; P$67 8.89,36.96; P$68 8.89,39.5; P$69 11.43,31.88; P$70 11.43,34.42; P$71 11.43,36.96; P$72 11.43,39.5; P$73 13.97,31.88; P$74 13.97,34.42; P$75 13.97,36.96; P$76 13.97,39.5; P$77 16.51,31.88; P$78 16.51,34.42; P$79 16.51,36.96; P$80 16.51,39.5; P$81 19.05,31.88; P$82 19.05,34.42; P$83 19.05,36.96; P$84 19.05,39.5; P$85 21.59,31.88; P$86 21.59,34.42; P$87 21.59,36.96; P$88 21.59,39.5; P$89 24.13,31.88; P$90 24.13,34.42; P$91 24.13,36.96; P$92 24.13,39.5; P$93 26.67,31.88; P$94 26.67,34.42; P$95 26.67,36.96; P$96 26.67,39.5; P$97 29.21,31.88; P$98 29.21,34.42; P$99 29.21,36.96; P$100 29.21,39.5; P$101 31.75,32.134; P$102 31.75,34.674; P$103 31.75,37.214; P$104 31.75,39.754
PSR400 = smd 2.7 x 5.2: P$1 0,0; P$2 8.3,0
DFN8(3X3)LT = smd 0.25 x 0.45: 1 -2.02,-0.08; 2 -1.52,-0.08; 3 -1.02,-0.08; 4 -0.52,-0.08; 5 -0.52,2.62; 6 -1.02,2.62; 7 -1.52,2.62; 8 -2.02,2.62 | smd 2.38 x 1.65: EXP -1.27,1.27
VSON8 = smd 0.4 x 0.7: P$1 0,0; P$2 0.65,0; P$3 1.3,0; P$4 1.95,0; P$5 0,3.15; P$6 0.65,3.15; P$7 1.3,3.15; P$8 1.95,3.15 | smd 2.54 x 1.27: P$9 1,1.6
SOT-23-8 = smd 0.45 x 1: 1 -0.975,-1.3; 2 -0.325,-1.3; 3 0.325,-1.3; 4 0.975,-1.3; 5 0.975,1.3; 6 0.325,1.3; 7 -0.325,1.3; 8 -0.975,1.3
SOT-23-3 = smd 0.8 x 0.9: 1 -0.95,-1; 2 0.95,-1; 3 0,1.1
TO-92-3 = drill 0.813 long: 1 -2.54,0; 2 0,0; 3 2.54,0
BATTERY_HOLDERS = hole 3.5: 28.5,-25.75; 28.5,8.75; -28.5,-25.75; -28.5,8.75
SOT-323 = smd 0.7 x 0.9: 1 -0.65,-0.95; 2 0.65,-0.95; 3 0,0.95
POWERDI5060-8 = smd 3.91 x 3.81: D1 0,0.44 | smd 0.61 x 1.02: D2 -1.905,2.795; D3 -0.635,2.795; D4 0.635,2.795; D5 1.905,2.795; G 1.905,-2.795; S1 -1.905,-2.795; S2 -0.635,-2.795; S3 0.635,-2.795
1X08_CONNECTOR = drill 1.016 pad 1.88: 2 2.54,-0.127; 3 5.08,0.127; 4 7.62,-0.127; 5 10.16,0.127; 6 12.7,-0.127; 7 15.24,0.127; 8 17.78,-0.127 | drill 1.016 pad 1.88 square: SBWTCK 0,0.127
TSOP-6 = smd 0.508 x 0.7: P$1 -1,-1.162; P$2 0,-1.162; P$3 1,-1.162; P$4 1,1.162; P$5 0,1.162; P$6 -1,1.162

### Placement (x,y rotation side)
BLK1  68.1,73.55 90 top
C1  21.69,84.25 270 top
C2  58.8,62 270 top
C3  16.61,80.75 90 top
C4  55.4,62 90 top
C5  23.91,84.25 90 top
C6  75.42,57.79 270 top
C7  72.37,54.87 180 top
C8  64.95,65.2 270 top
C9  37.1,39.85 90 top
C10  12.3,84.37 0 top
C11  8.8,79.61 0 top
C12  12.3,86.59 180 top
C13  40.1,37.15 0 top
C14  40.1,35.15 0 top
C15  37.15,55.95 270 top
C16  40.15,48.95 0 top
C17  40.15,46.95 0 top
C_CD  70.45,38.5 270 top
C_CD1  72.65,34.35 180 top
C_SLEW_1  39.48,20.01 180 top
C_SLEW_2  33.95,83.2 180 top
CIN  74.7,41.65 180 top
CIN3  36.34,28.93 0 top
CIN-  72,42.5 90 top
CONN1  41.1,3.25 0 top
CONN2  70,10.7 180 top
D1  56.2,88.4 180 top
D2  43.6,88.4 0 top
D3  49.9,88.4 180 top
J1  45.1,30 180 top
J2  40.1,32.8 0 top
J3  40.1,27.2 0 top
J4  58.7,48.1 0 top
J5  58.65,45.4 0 top
J6  72.35,27.65 270 top
JP3  72.2,30.45 180 top
JP6  74.9,30.35 270 top
R1  65.35,40.6 0 top
R2  65.35,38.95 0 top
R3  72.55,47.8 180 top
R4  72,24.05 90 top
R5  70.1,24.05 90 top
R6  74.85,20.1 270 top
R7  44.9,86.05 0 top
R8  70.5,61.3 0 top
R9  70.5,62.9 0 top
R10  55.55,86.15 180 top
R11  67.92,55.51 180 top
R12  67.92,57.41 180 top
R13  67.92,51.7 180 top
R14  67.92,53.6 180 top
R15  65.39,55.51 0 top
R16  65.39,57.41 0 top
R17  65.39,51.7 0 top
R18  65.39,53.6 0 top
R19  73.64,52.33 270 top
R20  71.1,52.33 270 top
R21  37.15,43.7 90 top
R22  40.1,44.65 0 top
R23  40.1,39.15 180 top
R24  37.1,36.15 270 top
R25  49.95,86.15 180 top
R29  57.1,62 270 top
R30  37.15,51.95 270 top
R31  40.15,56.45 0 top
R32  40.15,50.95 180 top
R33  37.15,47.95 270 top
R34  66.55,65.2 270 top
R_CB1  73.95,44.4 90 top
R_CB2  75.75,44.4 90 top
R_CB3  70.1,44.4 90 top
R_PULLUP1  36.94,17.47 90 top
R_SLEW_1  39.35,14.93 180 top
R_VD  74.45,32.7 180 top
U1  18.2,84.25 270 top
U4  12.3,81.19 0 top
U$1  45,45 90 top
U$2  45,45 90 top
U$3  31.59,27.59 90 top
U$4  37.24,30.53 0 top
U$5  74.2,39.4 180 top
U$6  72.37,57.41 90 top
U$7  71.05,20.3 180 top
U$8  32.35,80.2 0 top
U$9  [BATTERY_HOLDERS]  53,45 180 top
U$10  40.1,42.15 0 top
U$11  31.7,46 180 top
U$12  78.3,88.3 180 top
U$14  40.15,53.95 0 top
U$15  33.15,53.95 0 top
U$16  39.48,17.47 90 top

### Tracks (layer width: path | path; a pad name or v marks a point on that pad's centre or on a via)
3V3  (via drill 0.35)  (7 unrouted)
  Top 0.203: C6.1 74.05,58.66 U$6.4 | 67.26,51.46 67.93,50.79 69.35,50.79 69.53,50.97 69.53,54.36 71.07,55.91 71.7,55.91 71.88,56.08 71.88,56.59 72.86,57.58 72.86,58.09 73.04,58.27 73.55,58.27
  Top 0.254: C5.2 33.2,85.15 39.17,79.22 | 42.98,75.38 39.17,79.22 | 42.98,75.38 43,75.35 v49.25,75.35 | 42.98,75.38 BLK1.3.3V@CAN1 41.6,68.8 41.6,64.35 44.85,61.1 C4.1 R29.2 | BLK1.3.3V@CAN2 49.25,82.45 49.25,83.9 | 49.25,83.9 v49.25,83.95 | BLK1.3.3V@MSP1 60.37,83.9 49.25,83.9 | R8.2 R9.2 v71.5,64.3 73.2,64.3 73.92,65.02 BLK1.3.3V@MSP2 | R13.2 67.26,51.46 | 39.17,79.22 39.17,65.53 44.08,60.58 44.7,59.95 74.05,59.95 74.15,59.9 74.11,59.95 C6.1 | U$8.3 34.89,83.16 C_SLEW_2.1
  Top 0.61: U1.P$5 C1.1 C5.2
  Route2 0.254: v71.5,64.3 71.36,64.16
  Route15 0.254: 49.25,84 v49.25,83.95 v49.25,75.35 49.25,66.2 51.12,64.33 | 51.12,64.33 51.2,64.25 | 71.51,64.16 51.29,64.16 arc-90 51.12,64.33
  other vias: 49.25,75.9 72.05,64.3 48.55,83.95
3V3_MSP-ANALOG
  Top 0.254: 58.6,62.9 R29.1 | 58.6,62.9 C2.1 | BLK1.3.3V_ANALOG@MSP2 62.2,64.9 60.25,62.95 58.65,62.95 58.6,62.9
5V
  Top 0.254: BLK1.5V 40.55,81.2 33.15,88.6 13.41,88.6 C12.2
  Top 0.61: U4.P$5 C10.1 C12.2 11.34,86.59
ALCC_CC
  Top 0.254: 40.35,32.8 J2.1 | 40.35,32.8 J2.2 | U$4.6 36.26,33.19 36.26,33.49 36.48,33.7 37.19,33.7 38.1,32.8 40.35,32.8
BATT  (via drill 0.35)  (1 unrouted)
  Top 0.254: U$3.P$2 31.59,32.37 31.85,32.11 33.7,32.11 34.54,32.95 35.02,32.95 U$4.8 | C9.1 33.61,42.45 U$11.D2 | R1.1 63.3,40.6 v63.25,40.55
  Route2 0.254: v62.65,40.55 42,40.55 41.64,40.19 34.49,40.19 34.4,40.1 34.3,40.2 v34.25,40.2
  other vias: 33.65,40.2
  pour Top (no thermals): 29.8,47.45 27.3,44.95 27.3,37.6 27.3,36.25 28.95,34.6 34.6,34.6 35.2,35.2 35.2,42.3 33.6,43.9 33.6,46.85 33,47.45
  pour Top (no thermals): 33.45,44 33.45,42 29.95,42 29.95,44
BATT_NODE  (via drill 1.63 pad 3)
  Top 0.254: R19.2 72.81,50.6 72.81,48.04 73.05,47.8 R3.1 78.15,47.8 88.1,37.85 v88,36
BB+  (via drill 0.35)  (1 unrouted)
  Top 0.203: JP6.1 75.35,30.98
  Top 0.254: 75.35,30.98 R_VD.1 76.68,34.03 76.68,40 | R_CB2.2 75.75,44.97 76.68,44.04 76.68,40 | R2.2 66.2,40.65 R1.2 67.35,40.6 v67.4,40.65 v67.4,39.95 | v80.05,39.95 76.73,39.95 76.68,40
  Route2 0.254: v67.4,39.95 v80.05,39.95
  other vias: 80.05,40.55
BB_EN  (via drill 0.35)
  Top 0.254: U$7.3 R6.2 78.85,19.2 v79,19.6 v79,18.9 | v79,75.3 v78.4,75.3 BLK1.P2.5_GPIO
  Route15 0.254: v79,19.6 v79,75.3
CB_EN  (1 unrouted)
  Top 0.203: R4.2 72.35,25.3
  Top 0.254: 72.35,25.3 J6.1 | U$5.P$7 72.78,36.13 72.78,33.91 72.38,33.51 JP3.1
EN  (via drill 0.35)
  Top 0.203: C14.1 39.1,35.25 R24.2 | C17.1 39.15,47.05 R33.2
  Top 0.508: v37.6,46.05 v36.95,46.05 arc90 37.15,46.25 R33.2 | R24.2 arc90 36.85,35 v36.85,34.5 v37.45,34.5 | U$2.P$55 U$2.P$51
  Route15 0.508: v36.85,34.5 35.75,35.6 35.75,42.7 34.7,43.8 | 34.7,43.8 16.3,43.8 | v36.95,46.05 34.7,43.8
  pour Route15: 6.95,47.5 6.95,42.55 16.55,42.55 16.7,42.7 16.7,44.7 13.95,47.45 7.3,47.45 7.3,47.5
GND  (via drill 0.35)  (11 unrouted)
  Top 0.203: U$6.3 74.6,57.73 v74.48,57.77 | C6.2 75.42,56.52 v75.04,56.14 | R5.2 69.48,25.57 | v41.6,35.15 C14.2 C13.2 | v41.6,37.15 C13.2 | v41.85,39.15 R23.1 | v41.35,40.9 41.05,41.2 U$10.2 41,40.95 R23.1 | C13.2 R23.1 | v41.65,46.95 C17.2 C16.2 | v41.65,48.95 C16.2 | v41.9,50.95 R32.1 | v41.4,52.7 41.1,53 U$14.2 41.05,52.75 R32.1 | C16.2 R32.1 | CIN3.2 37.29,27.49 37.25,27.45 | v40.88,14.68 R_SLEW_1.1
  Top 0.254: v37,27.45 37.25,27.45 v37.6,27.45 | 69.48,25.57 JP3.2 | U$5.P$8 72.25,37.8 U$5.P$9 | CIN-.2 72,44.2 v72.3,44.5 v71.75,44.5 | v70.8,36.5 v70.15,36.5 arc90 70.45,36.8 C_CD.2 | C_CD1.2 70.65,34.35 v70.65,34.7 v70.65,34.05 | U$7.2 69.35,21.3 v69,21.65 v69,21.05 | v42.6,4.45 CONN1.P$2 | v45.6,4.45 CONN1.P$4 | v48.55,4.45 48.55,3.3 CONN1.P$6 | v51.6,4.45 CONN1.P$8 | R10.1 57.5,86.15 | v57.5,85.85 57.5,86.15 | v57.5,86.45 57.5,86.15 | R7.1 43.3,86.05 v42.95,86.4 v42.95,85.7 | R25.1 51.6,86.15 v51.95,86.5 v51.95,85.8 | U$4.7 35.72,32.05 35.86,31.91 | 35.86,31.91 U$4.EXP 36.22,31.55 U$4.3 | U$4.2 35.72,31.77 35.86,31.91 | C_SLEW_2.2 32.3,83.2 arc-90 v31.95,83.55 v31.95,82.9
  Top 0.305: v23.57,82.31 23.69,83.08 23.75,83.14 | 23.75,83.14 C5.1 | v24.2,82.31 23.75,82.89 23.75,83.14 | v16.26,78.82 16.39,79.59 C3.1 17.02,79.39 v16.9,78.82
  Top 0.61: U1.P$2 v15.66,84.25 v15.66,83.61 | U4.P$2 v12.3,78.66 v12.93,78.66 | v14.18,86.3 13.89,86.59 C12.1 13.83,86.59 v14.18,86.94 | v6.87,79.32 7.56,79.32 C11.1 7.22,79.61 v6.87,79.95
  other vias: 66.91,53.6 73.95,38.05 74.1,37.55 73.4,38.05 73.55,37.55 72.85,38.05 73.05,37.55 72.5,37.55 72.3,38.05 40.88,15.31 42.6,5.05 45.6,5.05 48.55,5.05 51.6,5.05
  pour Bottom: -0.25,90.3 89.4,90.3 90,90.9 90,0.05 -0.45,0.05 -0.45,89 -0.15,89
HEATERS
  Top 0.61: 47.2,6.8 49.25,6.8 50.15,5.9 50.15,3.3 CONN1.P$7 | 47.2,6.8 47.1,6.7 CONN1.P$5 | 43.95,6.8 47.1,6.8 47.2,6.8 | 43.95,6.8 41.9,6.8 41.1,6 CONN1.P$1 | CONN1.P$3 44.1,6.65 43.95,6.8
  Top 1.016: U$16.P$3 41.18,18.47 47,12.65 47,6.9 47.1,6.8
  pour Top (isolate 0.305, no thermals): 39.48,17.22 39.48,20.52 41,20.52 41,17.22
IN
  Top 0.203: U$15.S3 33.81,51.16 34.62,50.34 35.49,50.34 36.2,51.05 R30.2
  Top 0.254: R21.2 34.95,46.8 34.95,48.25 34.41,48.8 U$11.S1
  pour Top (no thermals): 33.7,48.5 33.7,50.5 31.2,50.5 31.2,48.5
  pour Top (no thermals): 31.15,51.45 31.15,49.45 33.65,49.45 33.65,51.45
INA219_A0_1
  Top 0.203: U$6.7 71.19,57.2 71.7,57.2 71.88,57.38 71.88,58.74 71.48,59.13 66.57,59.13 64.48,57.04 | 64.48,57.04 R15.1 R18.1 R17.1 | 64.48,57.04 R16.1
INA219_A1_1
  Top 0.203: R13.1 R14.1 R11.1 68.83,56.14 | R12.1 68.83,56.14 | U$6.8 69.12,56.44 68.83,56.14
INA219_IN+_1
  Top 0.203: U$6.1 73.27,56.03 C7.1 73.64,54.5 R19.1
INA219_IN-_1
  Top 0.203: 71.73,54.87 C7.2 | C7.2 71.1,54.5 R20.1 | C7.2 72.86,56.27 72.86,56.79 73.04,56.97 73.55,56.97 U$6.2
INA_SHUNT-
  Top 0.254: R_CB1.2 R_CB3.2 70.1,47.55 R3.2 72.1,47.8 72.35,48.05 72.35,50.58 R20.2
LDO_3V3_BYP1
  Top 0.61: U1.P$4 C1.2
LDO_5V_BYP1
  Top 0.61: U4.P$4 C10.2
N$1
  Top 0.254: BLK1.P3.5_GPIO_DEBUG 70.31,79.19 70.31,80.06 70.11,80.25 68.69,80.25 U$12.8 57.73,88.43 D1.A
N$2
  Top 0.203: 74.9,21.05 R6.1
  Top 0.254: JP6.2 74.9,21.05
N$3
  Top 0.254: U$12.7 70.85,80.38 BLK1.P3.4_GPIO_DEBUG
N$4
  Top 0.254: BLK1.P2.1_RXD 71.85,87.26 U$12.4
N$5
  Top 0.254: R_CB2.1 75.75,41.8 CIN.1 75.6,40.8 U$5.P$1
N$6
  Top 0.254: R_CB1.1 73.95,41.8 CIN.2 | CIN.2 arc90 73.55,41.4 U$5.P$2 | CIN.2 arc-90 73.75,41.6 CIN-.1
N$7
  Top 0.203: U$11.G 30.43,48.16 30.43,48.15 30.62,47.95 33.63,47.95 33.98,47.6 33.98,45.97 R21.1
  Top 0.254: C9.2 37.15,40.8 R21.1 37.35,42.8 R22.1
N$8
  Top 0.203: U$10.1 39.45,39.4 R23.2 C13.1 39.1,37.05 R24.1
N$9
  Top 0.254: U$5.P$3 72.78,39.52 72.78,39.89 72.59,40.08 71.91,40.08 70.1,41.89 R_CB3.1
N$10
  Top 0.254: U$5.P$4 C_CD.1
N$11
  Top 0.203: U$10.3 40.3,43.1 41.35,44.15 41.35,44.3 R22.2
N$12
  Top 0.254: U$7.1 R4.1 R5.1
N$13
  Top 0.254: R_VD.2 C_CD1.1 U$5.P$6
N$14
  Top 0.2: R30.1 C15.2
  Top 0.203: U$15.G 36.75,52.85 R30.1 | C15.2 37.85,55.05 R31.1
N$15  (via drill 1.63 pad 3)
  other vias: 16.5,16.6
N$16
  Top 0.203: U$14.1 39.5,51.2 R32.2 C16.1 39.15,48.85 R33.1
N$17
  Top 0.203: U$14.3 40.35,54.9 41.4,55.95 41.4,56.1 R31.2
N$18
  Top 0.254: BLK1.P2.0_TXD 73.7,87.69 U$12.3
N$19
  Top 0.254: BLK1.SBWTDIO 75.2,76.8 75.75,77.35 75.75,88.42 U$12.2
N$20
  Top 0.254: BLK1.SBWTCK 76.15,76.3 78.4,78.55 78.4,88.07 U$12.SBWTCK
N$21
  Top 0.254: D1.C R10.2
N$22
  Top 0.254: BLK1.P1.0_A0 64.35,66.7 64.9,66.15 | 64.9,66.15 C8.1 | R34.1 C8.1 | C8.1 64.9,66.15
N$23
  Top 0.254: D2.C 45.8,87.9 R7.2
N$24
  Top 0.254: D3.C 48.4,86.8 R25.2
N$25
  Top 0.203: U$16.P$1 40.01,15.84 39.47,15.84 38.82,15.18 R_SLEW_1.2
N$26
  Top 0.203: C_SLEW_1.2 38.58,19.24 39.03,18.79 39.03,17.15 38.79,16.91 38.76,16.91 U$16.P$6 37.04,16.47 R_PULLUP1.1
N$27
  Top 0.254: BLK1.P2.2_GPIO/PWM 71.31,79.19 71.31,80.57 66.87,85.01 66.87,88.95 66.13,89.7 52.7,89.7 D3.A
N$28
  Top 0.254: BLK1.P2.6_GPIO/PWM 65.37,75.8 62.93,78.23 62.93,82.6 60.6,84.94 43.16,84.94 43.15,84.95 42.15,84.95 41.8,85.3 41.8,88.1 D2.A
PACK+  (via drill 1.63 pad 3)
  Top 0.2: C15.1 35.61,56.85 U$15.D1
  Top 0.254: R2.1 51.95,38.95 51.65,38.65
  Top 0.406: CONN2.P$2 CONN2.P$1
  Top 0.813: CONN2.P$1 69.35,10.7 51.65,27.95 51.65,38.65 51.65,55.9 48.9,58.65 35.69,58.65 U$15.D4
  other vias: 16.5,53.5
  pour Top (no thermals): 31.4,55.95 31.4,57.95 34.9,57.95 34.9,55.95
  pour Top (no thermals): 18.75,58.05 34.95,58.05 34.95,52.6 31.05,52.6 26.35,47.9 19.55,47.9 14.85,52.6 14.85,54.15
RBF  (via drill 0.35)
  Top 0.406: CONN2.P$4 CONN2.P$3
  Top 0.813: v2,43.75 2,43.8 2.04,43.86 2.04,14.37 4.25,11.4 30.64,11.35 40.5,1.34 52.1,1.34 61.46,10.7 CONN2.P$4 | U$2.P$52 U$2.P$56
  Route15 0.813: v2,43.75 2.02,43.73 U$2.P$52
  other vias: 2,44.35 1.35,44.35 1.35,43.75
  pour Route15: 6.4,47.55 3.4,47.55 0.75,44.9 0.75,42.8 0.95,42.6 6.4,42.6
SCL  (via drill 0.35)
  Top 0.254: v68.6,63.25 arc90 68.85,63.5 BLK1.P7.1_I2C-SCL-2 | R9.1 68.95,62.9 arc-90 v68.6,63.25 | v68.6,62.55 v68.6,63.25
  Route15 0.254: J3.3 45.18,28.38 44.01,29.55 44.01,33.69 | 44,33.7 44.01,33.69 | 44.01,33.69 58.42,48.1 J4.1 58.7,53.35 v68.6,63.25
SCL_CC
  Top 0.254: J3.2 J3.1 40.1,28 37.65,30.45 U$4.4
SCL_INA  (2 unrouted)
  Top 0.2: J4.3 65.19,49.51 65.19,55.84
  Top 0.203: 70.83,58.38 70.49,58.72 68.13,58.72 67.71,58.3 67.71,58.1 R12.2 66.03,56.41 65.76,56.41 65.19,55.84
  Top 0.254: J4.3 J4.2
SDA  (via drill 0.35)
  Top 0.254: v68.6,61.55 68.31,61.84 68.09,61.84 67.89,62.03 67.89,63.77 68.35,64.22 BLK1.P7.0_I2C-SDA-2 | v68.6,61.55 v68.6,60.9 | v68.6,61.55 arc90 68.85,61.3 R8.1
  Route15 0.254: J1.1 58.65,43.55 J5.1 58.65,46.51 59.79,47.65 59.79,52.74 v68.6,61.55
SDA_CC
  Top 0.254: J1.2 J1.3 37.49,32.53 37.49,32.76 37.1,33.15 U$4.5
SDA_INA  (1 unrouted)
  Top 0.2: 65.59,48.74 65.59,47.26 J5.3
  Top 0.203: U$6.6 69.93,57.73 69.35,58.31 68.3,58.31 68.12,58.14 68.12,56.6 R11.2 66.03,54.51 65.76,54.51 65.59,54.33 65.59,48.74
  Top 0.254: J5.3 J5.2
SWITCH_EN  (via drill 0.35)  (2 unrouted)
  Top 0.203: v34.85,17.5 34.88,17.47 U$16.P$5
  Top 0.254: v76.45,74.45 76.15,74.8 BLK1.P4.3_GPIO
  Route2 0.203: 76.95,17.5 v76.9,17.5
  Route2 0.254: v34.85,17.5 v76.9,17.5
  Route15 0.254: v76.9,17.5 76.9,43.2 76.69,43.41 76.69,64.45 75.21,65.93 75.21,66.67 76.45,67.91 v76.45,74.45 76.5,74.5
  other vias: 34.25,17.5 77.05,74.45
SYNC1  (via drill 0.35)
  Top 0.254: v78,72.3 75.4,72.3 74.9,71.8 BLK1.P7.2_SYNC1
  Route2 0.254: U$2.P$45 40.64,41.19 41.06,41.61 41.64,41.61 41.8,41.45 v78.15,41.45
  Route15 0.254: v78.15,41.45 v78.15,42.05 78.15,43.4 78.16,43.41 78.16,43.99 78.15,44 78.2,71.95 78,72.15 v78,72.3 v78,72.9
SYNC2  (via drill 0.35)
  Top 0.254: v77.4,71.3 BLK1.PJ.3_SYNC2
  Route2 0.254: U$2.P$49 77.23,43.73 v77.4,43.7
  Route15 0.254: v77.4,43.7 v77.4,44.3 v77.4,70.7 v77.4,71.3
VDD  (1 unrouted)
  Top 0.254: U1.P$3 | C3.2 16.84,81.94 | U4.P$1 | U$2.P$33 U$2.P$34 9.31,34.84 4.97,34.84 4.96,34.85 3.4,34.85
  Top 0.508: U1.P$1 | 3.4,34.85 3.4,77.35 4.35,78.3 8.74,78.3 10.05,79.61 | 13.25,81.19 C3.2
  Top 0.61: U1.P$3 18.2,83.3 18.2,85.2 U1.P$1 | 16.84,81.94 U1.P$3 | U4.P$1 11.34,81.19 13.25,81.19 U4.P$3 | U4.P$1 11.11,79.61 10.05,79.61
VS
  Top 0.254: CIN3.1 35.22,29.6 U$4.1 35.02,30.64 34.54,30.64 33.74,31.65 31.85,31.65 31.59,31.39 U$3.P$1
  Top 0.813: U$16.P$4 37.04,18.47 R_PULLUP1.2
  Top 1.016: R_PULLUP1.2 30.81,24.5 30.7,24.5
  pour Top (no thermals): 26.1,32.15 14.4,32.25 4.2,32.25 4.25,29.45 4.2,29.4 4.2,22.4 4.4,22.2 30.1,22.2 34.1,26.2 34.1,28.6 33.85,28.85 29.15,28.85 29.05,28.95
VTEMP  (via drill 0.35)  (2 unrouted)
  Top 0.254: U$8.2 v32.35,63.3 | 66.5,63.3 v66.2,63.3 | 66.5,63.3 v66.9,63.3 | R34.2 66.55,63.35 66.5,63.3
  Route2 0.254: v32.35,63.3 66.25,63.3
  other vias: 33.05,63.3